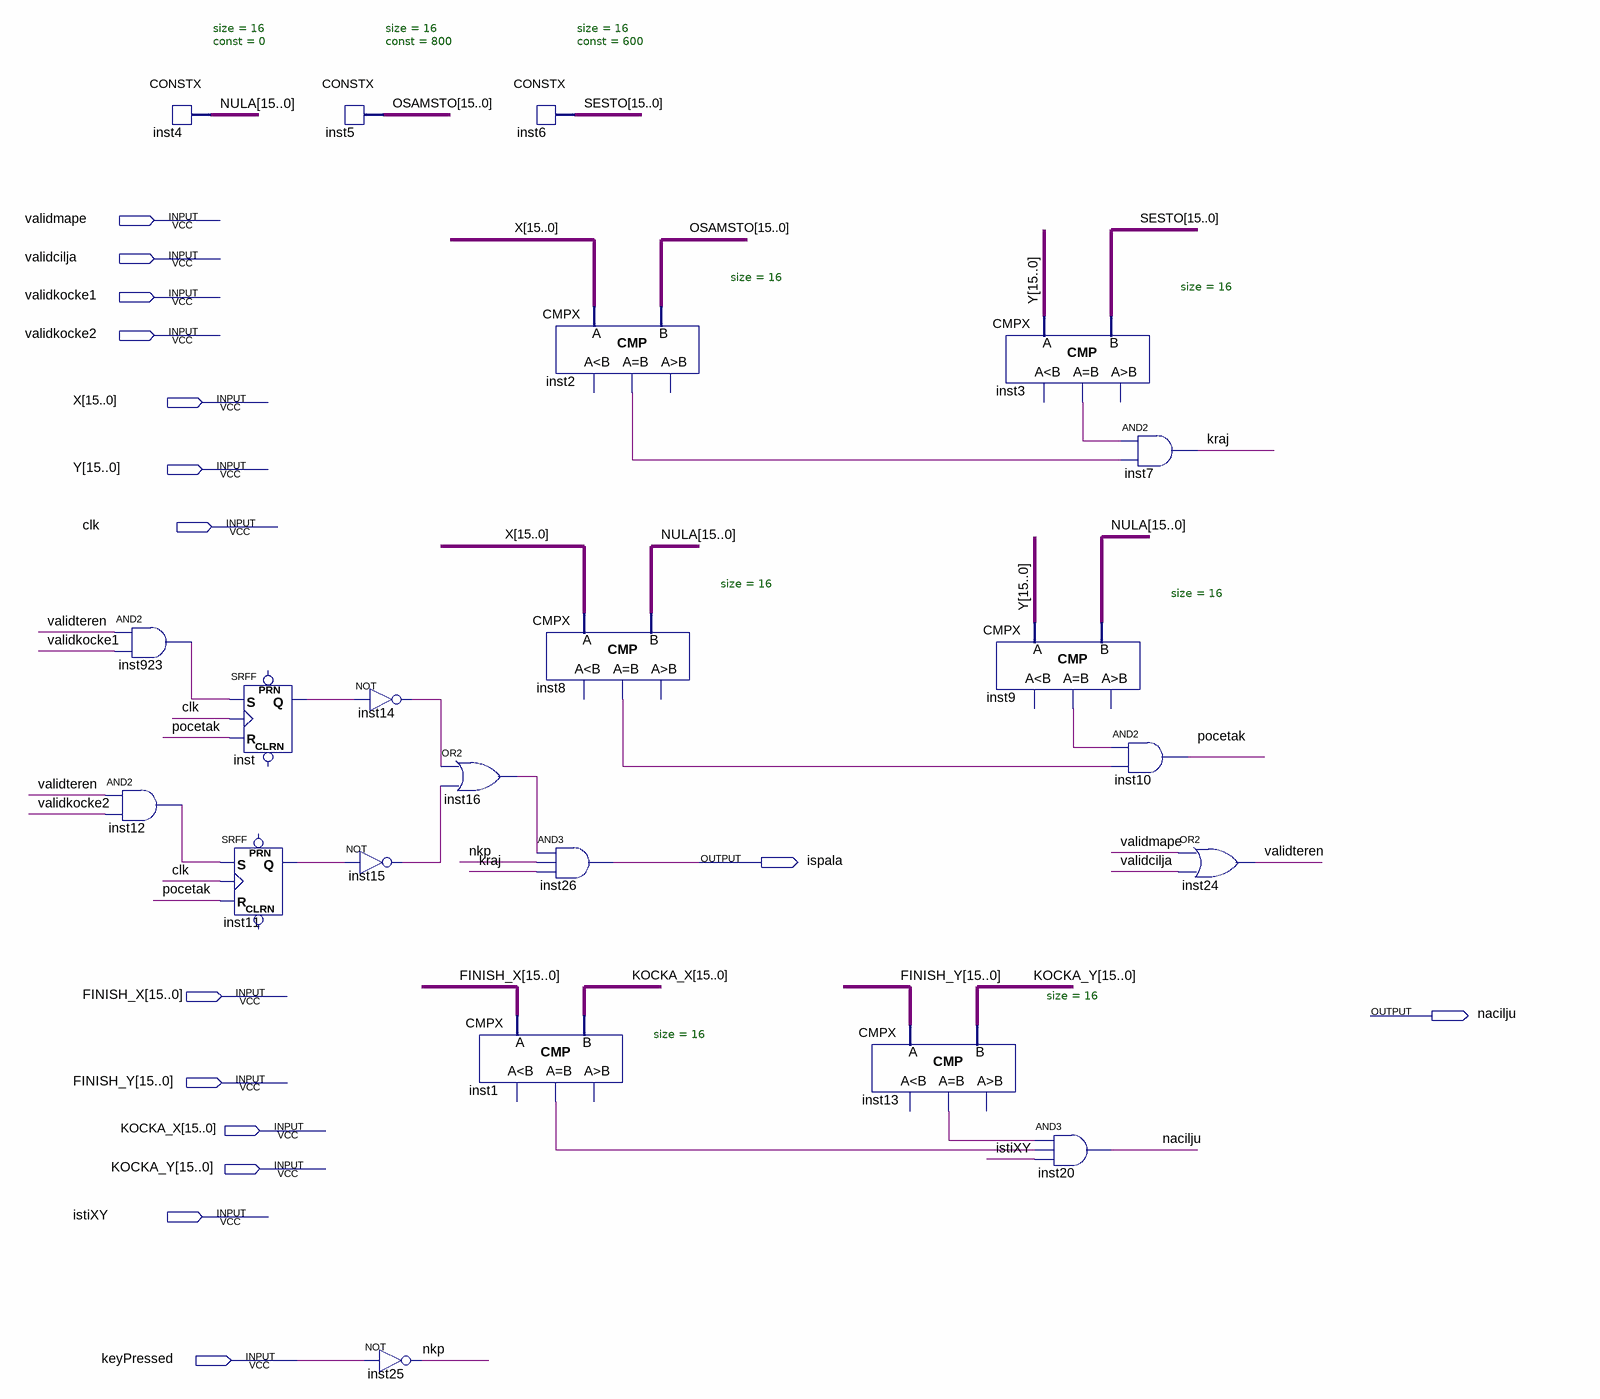
[diagram p0: schematic sheet]
// Quartus schematic detektor.bdf as structural Verilog: 22 symbols, 15 pins
module detektor (
  input  validmape,
  input  validcilja,
  input  validkocke1,
  input  validkocke2,
  input  [15:0] X,
  input  [15:0] Y,
  input  clk,
  input  [15:0] FINISH_X,
  input  [15:0] FINISH_Y,
  input  [15:0] KOCKA_X,
  input  [15:0] KOCKA_Y,
  input  istiXY,
  input  keyPressed,
  output ispala,
  output nacilju
);

  wire inst1_eq, inst2_eq, inst3_eq, inst8_eq, inst9_eq, inst11_q, inst12_out, inst13_eq, inst14_out,
       inst15_out, inst16_out, inst923_out, inst_q, kraj, nkp, pocetak, validteren;
  wire [15:0] NULA, OSAMSTO, SESTO;

  CONSTX #(.size(16), .\const (0)) inst4 (.data(NULA));
  and inst923 (inst923_out, validteren, validkocke1);
  and inst12 (inst12_out, validteren, validkocke2);
  SRFF inst (.S(inst923_out), .R(pocetak), .CLK(clk), .Q(inst_q));  // open: PRN, CLRN
  SRFF inst11 (.S(inst12_out), .R(pocetak), .CLK(clk), .Q(inst11_q));  // open: PRN, CLRN
  CONSTX #(.size(16), .\const (800)) inst5 (.data(OSAMSTO));
  not inst14 (inst14_out, inst_q);
  not inst15 (inst15_out, inst11_q);
  not inst25 (nkp, keyPressed);
  or inst16 (inst16_out, inst14_out, inst15_out);
  CMPX #(.size(16)) inst1 (.A(FINISH_X), .B(KOCKA_X), .eq(inst1_eq));  // open: ls, gr
  CONSTX #(.size(16), .\const (600)) inst6 (.data(SESTO));
  CMPX #(.size(16)) inst2 (.A(X), .B(OSAMSTO), .eq(inst2_eq));  // open: ls, gr
  CMPX #(.size(16)) inst8 (.A(X), .B(NULA), .eq(inst8_eq));  // open: ls, gr
  and inst26 (ispala, inst16_out, nkp, kraj);
  CMPX #(.size(16)) inst13 (.A(FINISH_Y), .B(KOCKA_Y), .eq(inst13_eq));  // open: ls, gr
  CMPX #(.size(16)) inst3 (.A(Y), .B(SESTO), .eq(inst3_eq));  // open: ls, gr
  CMPX #(.size(16)) inst9 (.A(Y), .B(NULA), .eq(inst9_eq));  // open: ls, gr
  and inst20 (nacilju, inst13_eq, inst1_eq, istiXY);
  and inst7 (kraj, inst3_eq, inst2_eq);
  and inst10 (pocetak, inst9_eq, inst8_eq);
  or inst24 (validteren, validmape, validcilja);
endmodule
